# EAGLE design MCU_breakout (EAGLE 7.3.0)
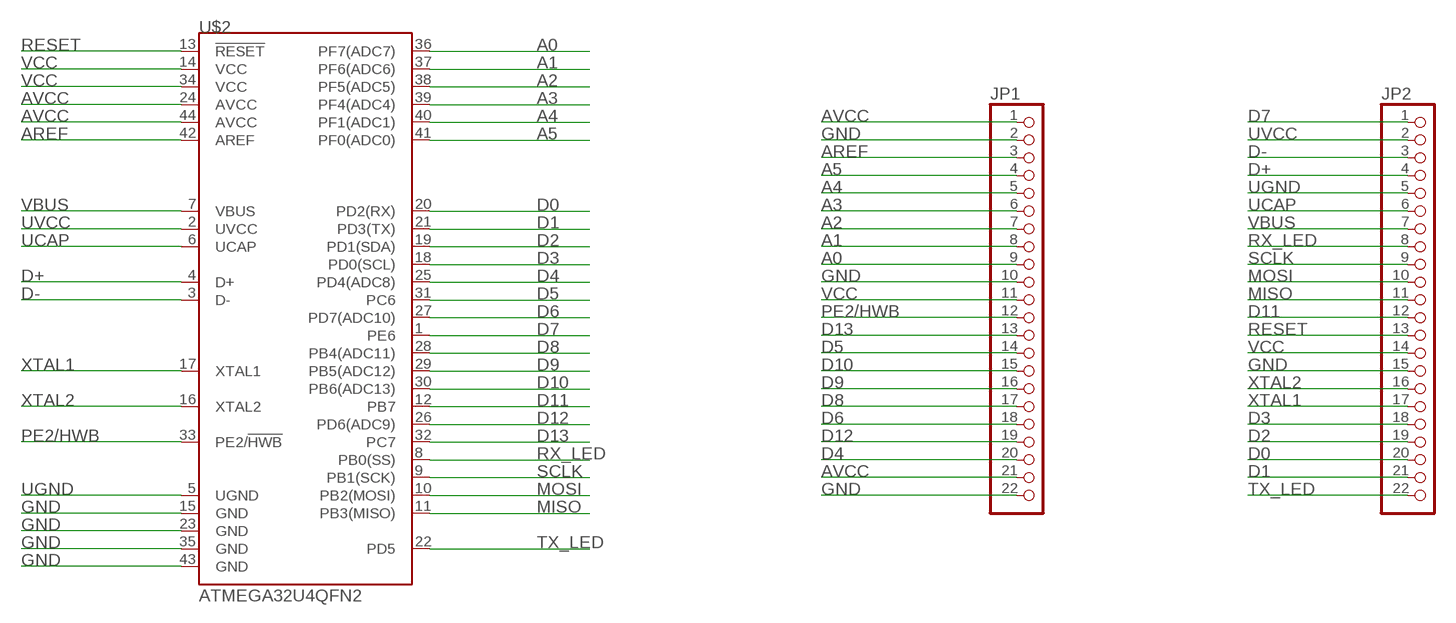
[diagram p0: schematic, sheet 1]

## Parts
JP1  PINHD-1X22  [1X22]
JP2  PINHD-1X22  [1X22]
U$2  ATMEGA32U4QFN2  [QFN-44-NOPAD]

## Nets
A0: JP1.9 U$2.36(PF7(ADC7))
A1: JP1.8 U$2.37(PF6(ADC6))
A2: JP1.7 U$2.38(PF5(ADC5))
A3: JP1.6 U$2.39(PF4(ADC4))
A4: JP1.5 U$2.40(PF1(ADC1))
A5: JP1.4 U$2.41(PF0(ADC0))
AREF: JP1.3 U$2.42(AREF)
AVCC: JP1.1 JP1.21 U$2.24(AVCC) U$2.44(AVCC)
D0: JP2.20 U$2.20(PD2(RX))
D1: JP2.21 U$2.21(PD3(TX))
D2: JP2.19 U$2.19(PD1(SDA))
D3: JP2.18 U$2.18(PD0(SCL))
D4: JP1.20 U$2.25(PD4(ADC8))
D5: JP1.14 U$2.31(PC6)
D6: JP1.18 U$2.27(PD7(ADC10))
D7: JP2.1 U$2.1(PE6)
D8: JP1.17 U$2.28(PB4(ADC11))
D9: JP1.16 U$2.29(PB5(ADC12))
D10: JP1.15 U$2.30(PB6(ADC13))
D11: JP2.12 U$2.12(PB7)
D12: JP1.19 U$2.26(PD6(ADC9))
D13: JP1.13 U$2.32(PC7)
D+: JP2.4 U$2.4(D+)
D-: JP2.3 U$2.3(D-)
GND: JP1.2 JP1.10 JP1.22 JP2.15 U$2.15(GND) U$2.23(GND) U$2.35(GND) U$2.43(GND)
MISO: JP2.11 U$2.11(PB3(MISO))
MOSI: JP2.10 U$2.10(PB2(MOSI))
PE2/HWB: JP1.12 U$2.33(PE2/!HWB)
RESET: JP2.13 U$2.13(!RESET)
RX_LED: JP2.8 U$2.8(PB0(SS))
SCLK: JP2.9 U$2.9(PB1(SCK))
TX_LED: JP2.22 U$2.22(PD5)
UCAP: JP2.6 U$2.6(UCAP)
UGND: JP2.5 U$2.5(UGND)
UVCC: JP2.2 U$2.2(UVCC)
VBUS: JP2.7 U$2.7(VBUS)
VCC: JP1.11 JP2.14 U$2.14(VCC) U$2.34(VCC)
XTAL1: JP2.17 U$2.17(XTAL1)
XTAL2: JP2.16 U$2.16(XTAL2)

## Library data of the parts
JP1 JP2 = pinhead:PINHD-1X22: PIN HEADER
U$2 = SparkFun-DigitalIC:ATMEGA32U4: Atmel 44-pin 8-bit Microcontroller with 32KBytes of ISP Flash and USB Controller

## Board
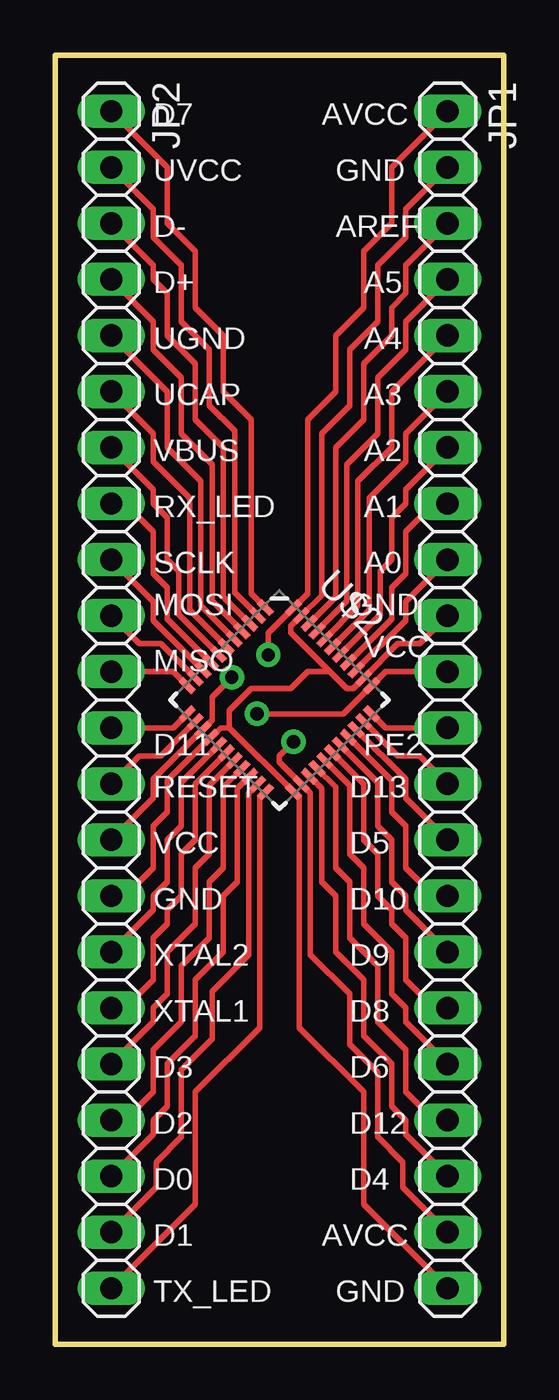
[diagram p1: board, top side]
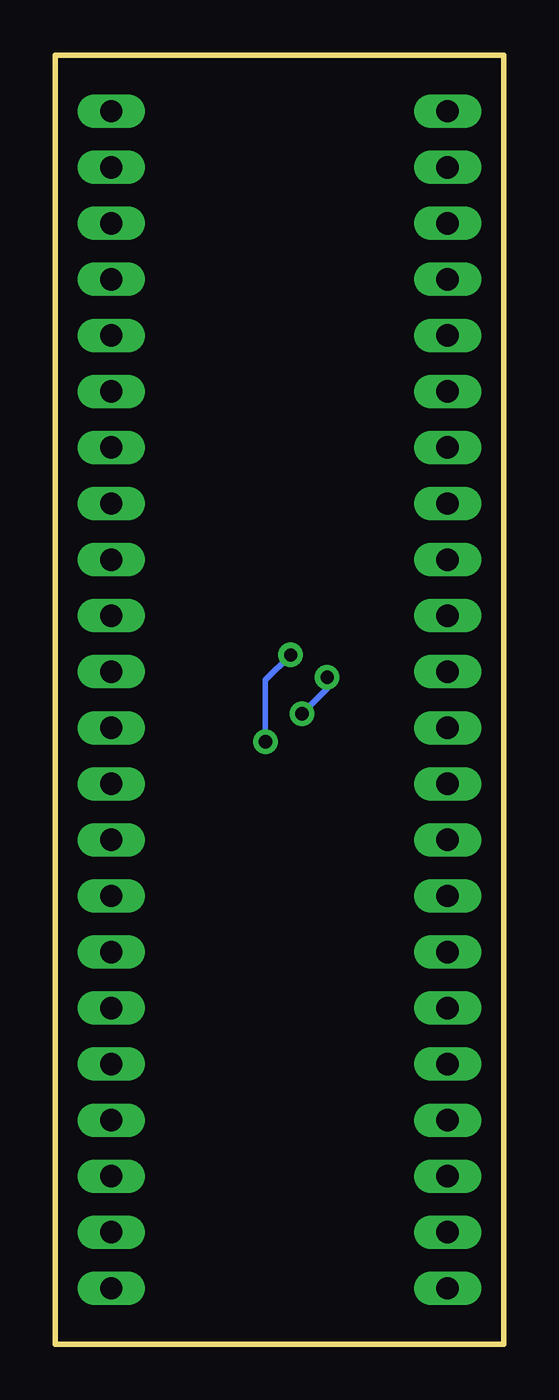
[diagram p2: board, bottom side, seen from below]

Size 20.32 x 58.42 mm. Coordinates in mm from the lower left corner, seen from the top.
Outline: 0,0 0,58.42 20.32,58.42 20.32,0 0,0
Copper layers (1*16): Top 0.035mm / dielectric 1.5mm / Bottom 0.035mm
Design rules "pcbtrain": minimum track width 0.2mm, minimum drill 0.4mm, track to track 0.2mm, track to pad 0.2mm, pad to pad 0.2mm, via to via 0.2mm, smd to smd 0mil, copper to edge 10mil, drill to drill 0.2mm, minimum pad ring 10mil, minimum via ring 10mil, stop-mask expansion 0.125mm, vias tented up to drill 0mil, thermal gap 10mil

### Footprints (pad centres in the part's own frame; a part is rotated, then mirrored left to right if it is on the bottom)
1X22 = drill 1.016 long: 1 -26.67,0; 2 -24.13,0; 3 -21.59,0; 4 -19.05,0; 5 -16.51,0; 6 -13.97,0; 7 -11.43,0; 8 -8.89,0; 9 -6.35,0; 10 -3.81,0; 11 -1.27,0; 12 1.27,0; 13 3.81,0; 14 6.35,0; 15 8.89,0; 16 11.43,0; 17 13.97,0; 18 16.51,0; 19 19.05,0; 20 21.59,0; 21 24.13,0; 22 26.67,0
QFN-44-NOPAD = smd 0.8 x 0.3: 1 -3.4,2.5; 2 -3.4,2; 3 -3.4,1.5; 4 -3.4,1; 5 -3.4,0.5; 6 -3.4,0; 7 -3.4,-0.5; 8 -3.4,-1; 9 -3.4,-1.5; 10 -3.4,-2; 11 -3.4,-2.5; 23 3.4,-2.5; 24 3.4,-2; 25 3.4,-1.5; 26 3.4,-1; 27 3.4,-0.5; 28 3.4,0; 29 3.4,0.5; 30 3.4,1; 31 3.4,1.5; 32 3.4,2; 33 3.4,2.5 | smd 0.3 x 0.8: 12 -2.5,-3.4; 13 -2,-3.4; 14 -1.5,-3.4; 15 -1,-3.4; 16 -0.5,-3.4; 17 0,-3.4; 18 0.5,-3.4; 19 1,-3.4; 20 1.5,-3.4; 21 2,-3.4; 22 2.5,-3.4; 34 2.5,3.4; 35 2,3.4; 36 1.5,3.4; 37 1,3.4; 38 0.5,3.4; 39 0,3.4; 40 -0.5,3.4; 41 -1,3.4; 42 -1.5,3.4; 43 -2,3.4; 44 -2.5,3.4

### Placement (x,y rotation side)
JP1  17.78,29.21 270 top
JP2  2.54,29.21 270 top
U$2  10.16,29.21 315 top

### Tracks (layer width: path | path; a pad name or v marks a point on that pad's centre or on a via)
A0
  Top 0.254: U$2.36 15.88,32.8 15.88,33.66 JP1.9
A1
  Top 0.254: U$2.37 15.24,32.88 15.24,34.29 15.88,34.92 15.88,36.83 17.14,38.1 JP1.8
A2
  Top 0.254: U$2.38 14.73,33.08 14.73,35.05 15.24,35.56 15.24,37.47 15.88,38.1 15.88,38.73 JP1.7
A3
  Top 0.254: U$2.39 14.22,33.27 14.22,38.35 15.88,40.01 15.88,41.27 JP1.6
A4
  Top 0.254: U$2.40 13.72,33.47 13.72,39.12 15.24,40.64 15.24,43.18 JP1.5
A5
  Top 0.254: U$2.41 13.21,33.67 13.21,39.88 14.61,41.27 14.61,43.81 15.88,45.09 15.88,46.35 JP1.4
AREF
  Top 0.254: U$2.42 12.7,33.87 12.7,40.64 13.97,41.91 13.97,44.45 15.24,45.72 15.24,46.99 15.88,47.62 15.88,48.9 JP1.3
AVCC  (via drill 0.6)
  Top 0.254: JP1.21 15.75,7.11 15.75,8.26 14.61,9.4 14.61,12.32 13.34,13.59 13.34,15.88 11.56,17.65 11.56,24.98 U$2.24 10.16,26.38 10.16,26.67 v10.79,27.3 | v9.65,31.24 9.65,32.24 U$2.44 11.43,34.02 11.43,41.91 12.7,43.18 12.7,45.72 13.97,46.99 13.97,49.53 15.24,50.8 15.24,53.34 JP1.1
  Bottom 0.254: v10.79,27.3 10.79,30.1 v9.65,31.24
D0
  Top 0.254: U$2.20 8.26,25.18 8.26,20.95 7.62,20.32 7.62,17.78 6.35,16.51 6.35,13.97 5.08,12.7 5.08,10.79 4.45,10.16 4.45,9.53 JP2.20
D1
  Top 0.254: U$2.21 8.76,24.98 8.76,17.65 7.11,16 7.11,13.84 5.71,12.45 5.71,9.4 4.57,8.26 4.57,7.11 JP2.21
D2
  Top 0.254: U$2.19 7.62,25.26 7.62,21.59 6.99,20.95 6.99,18.41 5.71,17.14 5.71,14.61 4.45,13.34 4.45,11.43 3.17,10.16 JP2.19
D3
  Top 0.254: U$2.18 6.99,25.33 6.99,22.23 6.35,21.59 6.35,19.05 5.08,17.78 5.08,15.88 4.45,15.24 4.45,14.61 JP2.18
D4
  Top 0.254: U$2.25 12.06,25.18 12.06,20.95 12.7,20.32 12.7,17.78 13.97,16.51 13.97,13.97 15.24,12.7 15.24,10.79 15.88,10.16 15.88,9.53 JP1.20
D5
  Top 0.254: U$2.31 15.88,25.62 15.88,24.77 JP1.14
D6
  Top 0.254: U$2.27 13.34,25.33 13.34,22.23 13.97,21.59 13.97,19.05 15.24,17.78 15.24,15.88 15.88,15.24 15.88,14.61 JP1.18
D7
  Top 0.254: JP2.1 5.08,53.34 5.08,50.8 6.35,49.53 6.35,46.99 7.62,45.72 7.62,43.18 8.89,41.91 8.89,34.02 U$2.1
D8
  Top 0.254: U$2.28 13.97,25.4 13.97,22.86 14.61,22.23 14.61,20.32 15.24,19.68 15.24,19.05 15.88,18.41 15.88,16.51 17.14,15.24 JP1.17
D9
  Top 0.254: U$2.29 14.61,25.47 14.61,23.5 15.24,22.86 15.24,20.95 15.88,20.32 15.88,19.68 JP1.16
D10
  Top 0.254: U$2.30 15.24,25.54 15.24,24.13 15.88,23.5 15.88,21.59 17.14,20.32 JP1.15
D11
  Top 0.254: U$2.12 5.35,27.94 JP2.12
D12
  Top 0.254: U$2.26 12.7,25.26 12.7,21.59 13.34,20.95 13.34,18.41 14.61,17.14 14.61,14.61 15.88,13.34 15.88,11.43 17.14,10.16 JP1.19
D13
  Top 0.254: U$2.32 15.53,26.67 16.51,26.67 JP1.13
D+
  Top 0.254: U$2.4 7.11,33.67 7.11,39.88 5.71,41.27 5.71,43.81 4.45,45.09 4.45,46.35 JP2.4
D-
  Top 0.254: U$2.3 7.62,33.87 7.62,40.64 6.35,41.91 6.35,44.45 5.08,45.72 5.08,47.62 4.45,48.26 4.45,48.9 JP2.3
GND
  Top 0.254: JP1.10 16.51,31.75 15.53,31.75 U$2.35 13.5,29.72 13.21,29.72 12.45,30.48 | JP2.15 3.17,20.32 4.45,21.59 4.45,23.5 5.08,24.13 5.08,25.54 U$2.15 7.07,27.51 7.49,27.94 7.89,27.94 | JP1.22 13.97,6.35 13.97,11.43 11.05,14.35 11.05,24.79 U$2.23 7.89,27.94 | 12.45,30.48 10.67,32.26 10.67,32.55 U$2.43 12.06,33.94 12.06,41.27 13.34,42.55 13.34,45.09 14.61,46.35 14.61,48.9 15.88,50.16 15.88,51.44 JP1.2 | 12.45,30.48 11.43,30.48 10.67,29.72 8.89,29.72 7.89,28.72 7.89,27.94
MISO
  Top 0.254: U$2.11 5.35,30.48 JP2.11
MOSI
  Top 0.254: U$2.10 4.79,31.75 3.81,31.75 JP2.10
PE2/HWB
  Top 0.254: U$2.33 14.97,27.94 JP1.12
RESET
  Top 0.254: U$2.13 4.79,26.67 3.81,26.67 JP2.13
RX_LED
  Top 0.254: U$2.8 5.08,32.88 5.08,34.29 4.45,34.92 4.45,36.83 3.17,38.1 JP2.8
SCLK
  Top 0.254: U$2.9 4.45,32.8 4.45,33.66 JP2.9
TX_LED
  Top 0.254: U$2.22 9.27,24.79 9.27,14.35 6.35,11.43 6.35,6.35 JP2.22
UCAP
  Top 0.254: U$2.6 6.1,33.27 6.1,38.35 4.45,40.01 4.45,41.27 JP2.6
UGND
  Top 0.254: U$2.5 6.6,33.47 6.6,39.12 5.08,40.64 5.08,43.18 JP2.5
UVCC
  Top 0.254: U$2.2 8.13,34.07 8.13,41.4 6.99,42.55 6.99,45.09 5.71,46.35 5.71,48.9 4.45,50.16 4.45,51.44 JP2.2
VBUS
  Top 0.254: U$2.7 5.59,33.08 5.59,35.05 5.08,35.56 5.08,37.47 4.45,38.1 4.45,38.73 JP2.7
VCC  (via drill 0.6)
  Top 0.254: JP1.11 14.97,30.48 U$2.34 13.06,28.57 v9.14,28.57 | JP2.14 4.45,24.77 4.45,25.62 U$2.14 7.11,28.28 7.11,29.34 v8,30.23
  Bottom 0.254: v9.14,28.57 8,29.72 v8,30.23
XTAL1
  Top 0.254: U$2.17 6.35,25.4 6.35,22.86 5.71,22.23 5.71,20.32 5.08,19.68 5.08,19.05 4.45,18.41 4.45,16.51 3.17,15.24 JP2.17
XTAL2
  Top 0.254: U$2.16 5.71,25.47 5.71,23.5 5.08,22.86 5.08,20.95 4.45,20.32 4.45,19.68 JP2.16

### Text on the board
tPlace: D7 | AVCC | UVCC | GND | D- | AREF | D+ | A5 | UGND | A4 | UCAP | A3 | VBUS | A2 | RX_LED | A1 | SCLK | A0 | MOSI | GND | VCC | MISO | D11 | PE2 | RESET | D13 | VCC | D5 | GND | D10 | XTAL2 | D9 | XTAL1 | D8 | D3 | D6 | D2 | D12 | D0 | D4 | D1 | AVCC | TX_LED | GND